# Altium project Communication.PrjPcb
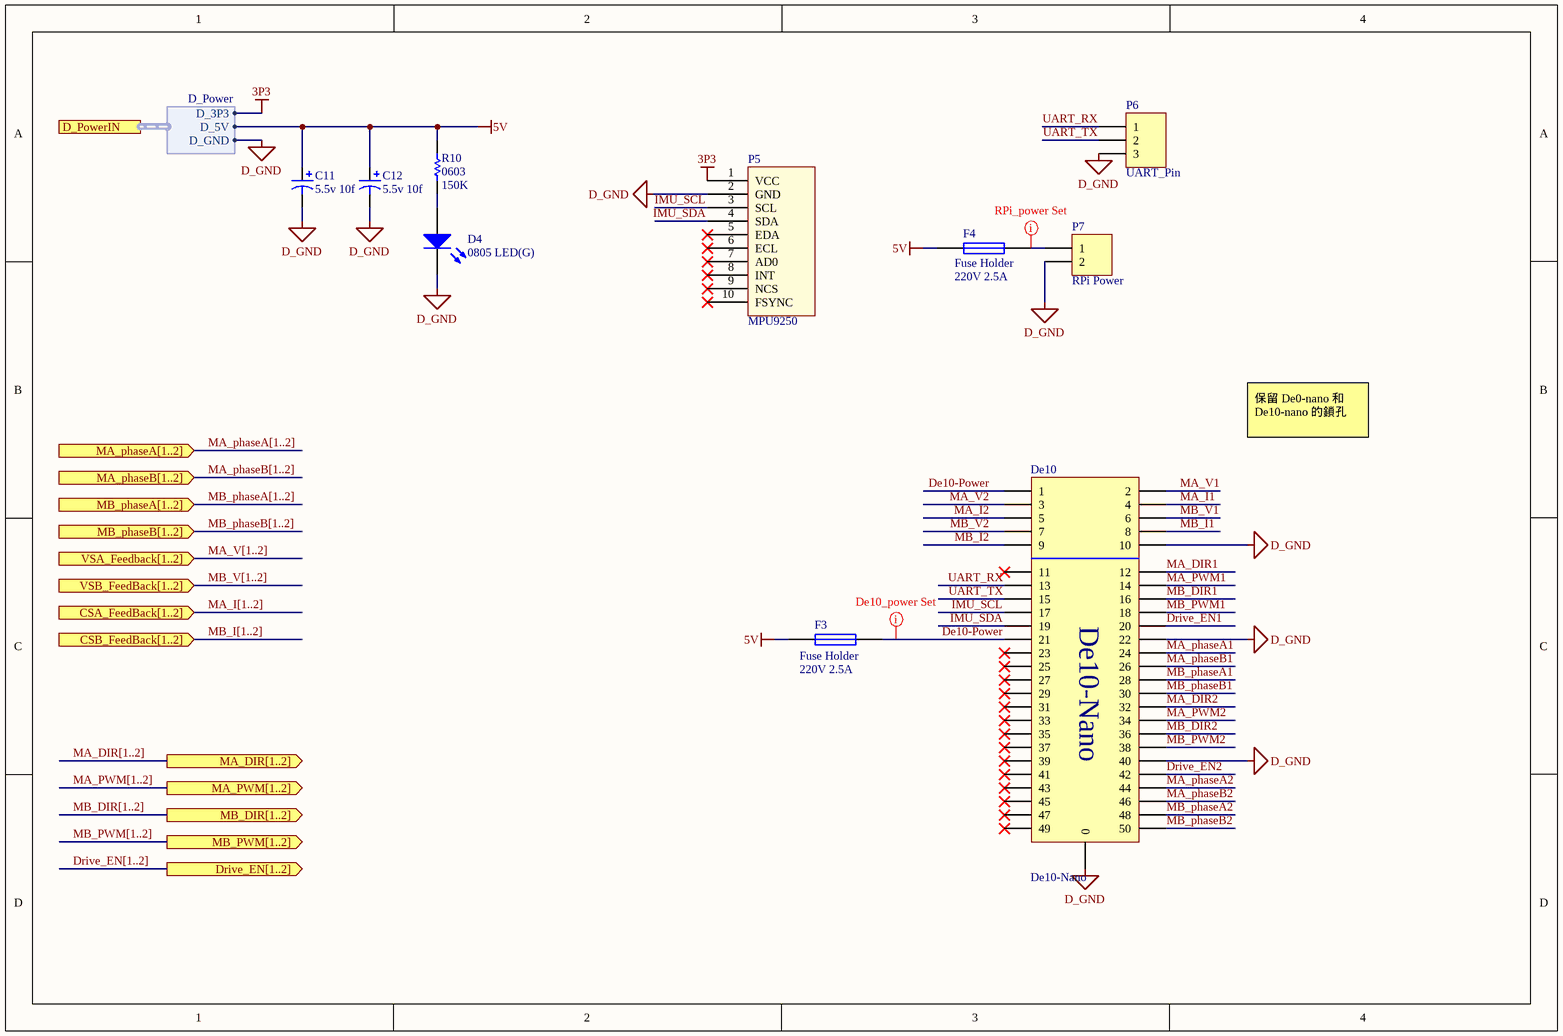
[diagram p0: Communication.SchDoc]
1 sheet, 10 parts. Net scope: flat (ports and power ports of the same name join across sheets).
Board file: Communication.PcbDoc

## Sheet Communication.SchDoc
size A4; SheetNumber: 4; SheetTotal: 5; SPICEModelCacheIYTLMHPF: <root> / <DocumentId>IYTLMHPF</DocumentId> / <CacheFrame Number="0"> / <Model Name="led0" Kind="MDL"> / <Text>*Typ INFRARED GaAs LED: Vf=1.2V Vr=5V If=40mA trr=3uS / *LED Pinout: 1=A, 2=K / .MODEL LED0 D (IS=93.5P RS=84M N=2.63 BV=5 IBV=10U / + CJO=2.97P VJ=.75 M=.333 TT=4.32U)</Text> / </Model> / </CacheFrame> / </root>

### Parts
C11  5.5v 10f  [SUPPYCAP-DIP_L33.0_W16.5]
C12  5.5v 10f  [SUPPYCAP-DIP_L33.0_W16.5]
D4  0805 LED(G)  [0805 SMD DIode]
De10  De10-Nano  [De10-Nano]
F3  Fuse Holder  value 220V 2.5A  [SMD Fuses Holder]
F4  Fuse Holder  value 220V 2.5A  [SMD Fuses Holder]
P5  MPU9250  [MPU9250]
P6  UART_Pin  [B3B-XH-A]
P7  RPi Power  [B2B-XH-A]
R10  0603  value 150K  [0603 SMD Res]

### Ports
CSA_FeedBack[1..2] (in), CSB_FeedBack[1..2] (in), D_PowerIN (harness D_Power), Drive_EN[1..2] (out), MA_DIR[1..2] (out), MA_phaseA[1..2] (in), MA_phaseB[1..2] (in), MA_PWM[1..2] (out), MB_DIR[1..2] (out), MB_phaseA[1..2] (in), MB_phaseB[1..2] (in), MB_PWM[1..2] (out), VSA_Feedback[1..2] (in), VSB_FeedBack[1..2] (in)

### Harnesses
D_Power: D_3P3, D_5V, D_GND

### Nets
3P3: P5.1(VCC) ; port D_PowerIN.D_3P3
5V: C11.1 C12.1 F3.1 F4.1 R10.2 ; port D_PowerIN.D_5V
D_GND: C11.2 C12.2 D4.2(K) De10.0 De10.10 De10.22 De10.40 P5.2(GND) P6.3 P7.2 ; port D_PowerIN.D_GND
De10-Power: De10.1 De10.21 F3.2
Drive_EN1: De10.20
Drive_EN2: De10.42
IMU_SCL: De10.17 P5.3(SCL)
IMU_SDA: De10.19 P5.4(SDA)
MA_DIR1: De10.12
MA_DIR2: De10.32
MA_I1: De10.4
MA_I2: De10.5
MA_phaseA1: De10.24
MA_phaseA2: De10.44
MA_phaseB1: De10.26
MA_phaseB2: De10.46
MA_PWM1: De10.14
MA_PWM2: De10.34
MA_V1: De10.2
MA_V2: De10.3
MB_DIR1: De10.16
MB_DIR2: De10.36
MB_I1: De10.8
MB_I2: De10.9
MB_phaseA1: De10.28
MB_phaseA2: De10.48
MB_phaseB1: De10.30
MB_phaseB2: De10.50
MB_PWM1: De10.18
MB_PWM2: De10.38
MB_V1: De10.6
MB_V2: De10.7
UART_RX: De10.13 P6.1
UART_TX: De10.15 P6.2
NetD4_1: D4.1(A) R10.1
NetF4_2: F4.2 P7.1

Not connected (* = marked no-connect by the designer): De10 11* 23* 25* 27* 29* 31* 33* 35* 37* 39* 41* 43* 45* 47* 49*; P5 5(EDA)* 6(ECL)* 7(AD0)* 8(INT)* 9(NCS)* 10(FSYNC)*

### Buses and harness runs
bus Drive_EN[1..2] = port Drive_EN[1..2]
bus MA_DIR[1..2] = port MA_DIR[1..2]
bus MA_I[1..2] = port CSA_FeedBack[1..2]
bus MA_phaseA[1..2] = port MA_phaseA[1..2]
bus MA_phaseB[1..2] = port MA_phaseB[1..2]
bus MA_PWM[1..2] = port MA_PWM[1..2]
bus MA_V[1..2] = port VSA_Feedback[1..2]
bus MB_DIR[1..2] = port MB_DIR[1..2]
bus MB_I[1..2] = port CSB_FeedBack[1..2]
bus MB_phaseA[1..2] = port MB_phaseA[1..2]
bus MB_phaseB[1..2] = port MB_phaseB[1..2]
bus MB_PWM[1..2] = port MB_PWM[1..2]
bus MB_V[1..2] = port VSB_FeedBack[1..2]

### Layout directives
net class De10_power; rule Clearance Constraint [Generic clearance = 0.61mm, and 9 value(s) for objects]; rule Width Constraint [Pref Width = 0.41mm    Min Width = 0.41mm    Max Width = 0.45mm]; rule Routing Via Style [Pref Size = 20mil    Pref Hole Size = 10mil]: De10-Power, NetF4_2

### Notes on the sheet
- 保留 De0-nano 和 De10-nano 的鎖孔

### Library data of the parts
C11 C12 = Cap Pol1: Super Capacitor; Published: 8-Jun-2000; LatestRevisionDate: 17-Jul-2002; LatestRevisionNote: Re-released for DXP Platform.; PackageReference: RB7.6-15; Publisher: Altium Limited; PackageDescription: Polarized Capacitor (Radial); 2 Leads
D4 = LED0: Typical INFRARED GaAs LED; Published: 8-Jun-2000; LatestRevisionDate: 08-Jul-2005; LatestRevisionNote: Mech Layer 1 removed.; PackageReference: LED-0; Publisher: Altium Limited; PackageDescription: LED; 2 Leads
F3 F4 = Fuse 1: 0451005.MRL; Published: 8-Jun-2000; LatestRevisionDate: 17-Jul-2002; LatestRevisionNote: Re-released for DXP Platform.; PackageReference: PIN-W2/E2.8; Publisher: Altium Limited; PackageDescription: Thru-Hole; 2 Leads
P5 = IMU Pin: 3 axis Gyro, Acceleration, Magmetic
P6 = Header 3: B3B-XH-A; LatestRevisionDate: 17-Jul-2002; LatestRevisionNote: Re-released for DXP Platform.; Publisher: Altium Limited
P7 = Header 2: B2B-XH-A; LatestRevisionDate: 17-Jul-2002; LatestRevisionNote: Re-released for DXP Platform.; Publisher: Altium Limited
R10 = Res1: Resistor; Published: 8-Jun-2000; LatestRevisionDate: 17-Jul-2002; LatestRevisionNote: Re-released for DXP Platform.; PackageReference: AXIAL-0.3; Publisher: Altium Limited; PackageDescription: Axial Device, Thru-Hole; 2 Leads; 0.3 in Pin Spacing